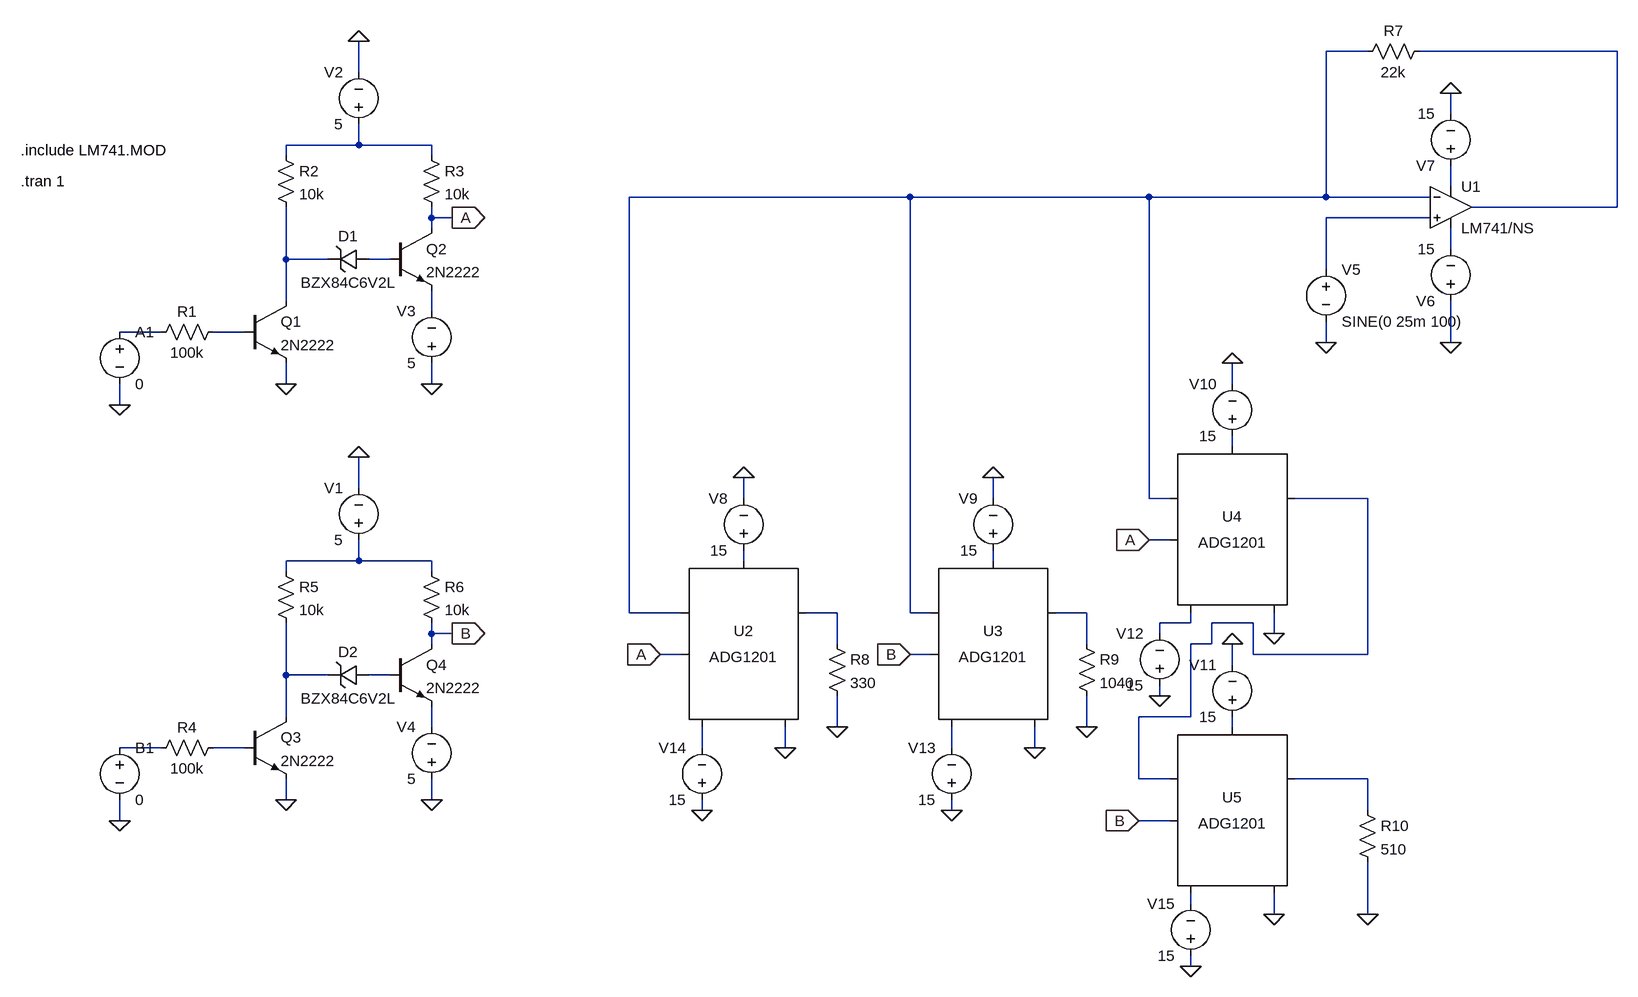
[diagram p0: schematic PGA_Modified_3Branch.asc]
PGA_Modified_3Branch.asc, the LTspice schematic file:
Version 4.1
SHEET 1 2020 1188
WIRE 1632 -240 1568 -240
WIRE 2016 -240 1712 -240
WIRE 80 -208 80 -256
WIRE 1760 -144 1760 -176
WIRE 80 -96 80 -128
WIRE 80 -96 -32 -96
WIRE 192 -96 80 -96
WIRE -32 -80 -32 -96
WIRE 192 -80 192 -96
WIRE 1760 -32 1760 -64
WIRE 928 -16 496 -16
WIRE 1296 -16 928 -16
WIRE 1568 -16 1568 -240
WIRE 1568 -16 1296 -16
WIRE 1728 -16 1568 -16
WIRE 2016 0 2016 -240
WIRE 2016 0 1792 0
WIRE 192 16 192 0
WIRE 224 16 192 16
WIRE 1728 16 1568 16
WIRE 192 32 192 16
WIRE 1760 64 1760 32
WIRE -32 80 -32 0
WIRE 32 80 -32 80
WIRE 128 80 96 80
WIRE 1568 96 1568 16
WIRE -32 144 -32 80
WIRE 192 160 192 128
WIRE -224 192 -288 192
WIRE -96 192 -144 192
WIRE 1568 208 1568 176
WIRE 1760 208 1760 144
WIRE -32 272 -32 240
WIRE 192 272 192 240
WIRE 1424 272 1424 240
WIRE -288 304 -288 272
WIRE 1424 368 1424 352
WIRE 80 432 80 384
WIRE 672 448 672 416
WIRE 1056 448 1056 416
WIRE 1296 448 1296 -16
WIRE 1328 448 1296 448
WIRE 1632 448 1520 448
WIRE 1328 512 1296 512
WIRE 80 544 80 512
WIRE 80 544 -32 544
WIRE 192 544 80 544
WIRE 672 544 672 528
WIRE 1056 544 1056 528
WIRE -32 560 -32 544
WIRE 192 560 192 544
WIRE 496 624 496 -16
WIRE 576 624 496 624
WIRE 816 624 768 624
WIRE 928 624 928 -16
WIRE 960 624 928 624
WIRE 1200 624 1152 624
WIRE 1360 640 1360 624
WIRE 1360 640 1312 640
WIRE 1456 640 1392 640
WIRE 192 656 192 640
WIRE 224 656 192 656
WIRE 1312 656 1312 640
WIRE 1488 656 1488 624
WIRE 192 672 192 656
WIRE 816 672 816 624
WIRE 1200 672 1200 624
WIRE 1392 672 1392 640
WIRE 1392 672 1360 672
WIRE 576 688 544 688
WIRE 960 688 928 688
WIRE 1456 688 1456 640
WIRE 1632 688 1632 448
WIRE 1632 688 1456 688
WIRE 1424 704 1424 672
WIRE -32 720 -32 640
WIRE 32 720 -32 720
WIRE 128 720 96 720
WIRE 1312 752 1312 736
WIRE -32 784 -32 720
WIRE 1360 784 1360 672
WIRE 1360 784 1280 784
WIRE 192 800 192 768
WIRE 816 800 816 752
WIRE 1200 800 1200 752
WIRE 1424 800 1424 784
WIRE -224 832 -288 832
WIRE -96 832 -144 832
WIRE 608 832 608 800
WIRE 736 832 736 800
WIRE 992 832 992 800
WIRE 1120 832 1120 800
WIRE 1280 880 1280 784
WIRE 1328 880 1280 880
WIRE 1632 880 1520 880
WIRE -32 912 -32 880
WIRE 192 912 192 880
WIRE 608 928 608 912
WIRE 992 928 992 912
WIRE 1632 928 1632 880
WIRE -288 944 -288 912
WIRE 1328 944 1280 944
WIRE 1360 1072 1360 1056
WIRE 1488 1088 1488 1056
WIRE 1632 1088 1632 1008
WIRE 1360 1168 1360 1152
FLAG 80 -256 0
FLAG -288 304 0
FLAG -32 272 0
FLAG 192 272 0
FLAG 224 16 A
IOPIN 224 16 Out
FLAG 80 384 0
FLAG -288 944 0
FLAG -32 912 0
FLAG 192 912 0
FLAG 224 656 B
IOPIN 224 656 Out
FLAG 1760 208 0
FLAG 1760 -176 0
FLAG 1568 208 0
FLAG 1488 656 0
FLAG 1488 1088 0
FLAG 1120 832 0
FLAG 736 832 0
FLAG 1424 672 0
FLAG 672 416 0
FLAG 1056 416 0
FLAG 1424 240 0
FLAG 1312 752 0
FLAG 608 928 0
FLAG 992 928 0
FLAG 1360 1168 0
FLAG 816 800 0
FLAG 1200 800 0
FLAG 1632 1088 0
FLAG 544 688 A
IOPIN 544 688 In
FLAG 928 688 B
IOPIN 928 688 In
FLAG 1296 512 A
IOPIN 1296 512 In
FLAG 1280 944 B
IOPIN 1280 944 In
SYMBOL OpAmps\\opamp2 1760 -64 R0
SYMATTR InstName U1
SYMATTR Value LM741/NS
SYMBOL npn -96 144 R0
SYMATTR InstName Q1
SYMATTR Value 2N2222
SYMBOL npn 128 32 R0
SYMATTR InstName Q2
SYMATTR Value 2N2222
SYMBOL voltage -288 176 R0
WINDOW 123 0 0 Left 0
WINDOW 39 0 0 Left 0
SYMATTR InstName A1
SYMATTR Value 0
SYMBOL res -128 176 R90
WINDOW 0 0 56 VBottom 2
WINDOW 3 32 56 VTop 2
SYMATTR InstName R1
SYMATTR Value 100k
SYMBOL zener 96 64 R90
WINDOW 0 -4 32 VBottom 2
WINDOW 3 36 32 VTop 2
SYMATTR InstName D1
SYMATTR Value BZX84C6V2L
SYMBOL res -48 -96 R0
SYMATTR InstName R2
SYMATTR Value 10k
SYMBOL res 176 -96 R0
SYMATTR InstName R3
SYMATTR Value 10k
SYMBOL voltage 80 -112 R180
WINDOW 0 24 96 Left 2
WINDOW 3 24 16 Left 2
WINDOW 123 0 0 Left 0
WINDOW 39 0 0 Left 0
SYMATTR InstName V2
SYMATTR Value 5
SYMBOL voltage 192 256 R180
WINDOW 0 24 96 Left 2
WINDOW 3 24 16 Left 2
WINDOW 123 0 0 Left 0
WINDOW 39 0 0 Left 0
SYMATTR InstName V3
SYMATTR Value 5
SYMBOL npn -96 784 R0
SYMATTR InstName Q3
SYMATTR Value 2N2222
SYMBOL npn 128 672 R0
SYMATTR InstName Q4
SYMATTR Value 2N2222
SYMBOL voltage -288 816 R0
WINDOW 123 0 0 Left 0
WINDOW 39 0 0 Left 0
SYMATTR InstName B1
SYMATTR Value 0
SYMBOL res -128 816 R90
WINDOW 0 0 56 VBottom 2
WINDOW 3 32 56 VTop 2
SYMATTR InstName R4
SYMATTR Value 100k
SYMBOL zener 96 704 R90
WINDOW 0 -4 32 VBottom 2
WINDOW 3 36 32 VTop 2
SYMATTR InstName D2
SYMATTR Value BZX84C6V2L
SYMBOL res -48 544 R0
SYMATTR InstName R5
SYMATTR Value 10k
SYMBOL res 176 544 R0
SYMATTR InstName R6
SYMATTR Value 10k
SYMBOL voltage 80 528 R180
WINDOW 0 24 96 Left 2
WINDOW 3 24 16 Left 2
WINDOW 123 0 0 Left 0
WINDOW 39 0 0 Left 0
SYMATTR InstName V1
SYMATTR Value 5
SYMBOL voltage 192 896 R180
WINDOW 0 24 96 Left 2
WINDOW 3 24 16 Left 2
WINDOW 123 0 0 Left 0
WINDOW 39 0 0 Left 0
SYMATTR InstName V4
SYMATTR Value 5
SYMBOL voltage 1568 80 R0
WINDOW 123 0 0 Left 0
WINDOW 39 0 0 Left 0
SYMATTR InstName V5
SYMATTR Value SINE(0 25m 100)
SYMBOL voltage 1760 160 R180
WINDOW 123 0 0 Left 0
WINDOW 39 0 0 Left 0
SYMATTR InstName V6
SYMATTR Value 15
SYMBOL voltage 1760 -48 R180
WINDOW 123 0 0 Left 0
WINDOW 39 0 0 Left 0
SYMATTR InstName V7
SYMATTR Value 15
SYMBOL res 1728 -256 R90
WINDOW 0 0 56 VBottom 2
WINDOW 3 32 56 VTop 2
SYMATTR InstName R7
SYMATTR Value 22k
SYMBOL Switches\\ADG1201 672 672 R0
SYMATTR InstName U2
SYMBOL Switches\\ADG1201 1056 672 R0
SYMATTR InstName U3
SYMBOL Switches\\ADG1201 1424 496 R0
SYMATTR InstName U4
SYMBOL Switches\\ADG1201 1424 928 R0
SYMATTR InstName U5
SYMBOL voltage 672 544 R180
WINDOW 0 24 96 Left 2
WINDOW 3 24 16 Left 2
WINDOW 123 0 0 Left 0
WINDOW 39 0 0 Left 0
SYMATTR InstName V8
SYMATTR Value 15
SYMBOL voltage 1056 544 R180
WINDOW 0 24 96 Left 2
WINDOW 3 24 16 Left 2
WINDOW 123 0 0 Left 0
WINDOW 39 0 0 Left 0
SYMATTR InstName V9
SYMATTR Value 15
SYMBOL voltage 1424 368 R180
WINDOW 0 24 96 Left 2
WINDOW 3 24 16 Left 2
WINDOW 123 0 0 Left 0
WINDOW 39 0 0 Left 0
SYMATTR InstName V10
SYMATTR Value 15
SYMBOL voltage 1424 800 R180
WINDOW 0 24 96 Left 2
WINDOW 3 24 16 Left 2
WINDOW 123 0 0 Left 0
WINDOW 39 0 0 Left 0
SYMATTR InstName V11
SYMATTR Value 15
SYMBOL voltage 1312 752 R180
WINDOW 0 24 96 Left 2
WINDOW 3 24 16 Left 2
WINDOW 123 0 0 Left 0
WINDOW 39 0 0 Left 0
SYMATTR InstName V12
SYMATTR Value 15
SYMBOL voltage 992 928 R180
WINDOW 0 24 96 Left 2
WINDOW 3 24 16 Left 2
WINDOW 123 0 0 Left 0
WINDOW 39 0 0 Left 0
SYMATTR InstName V13
SYMATTR Value 15
SYMBOL voltage 608 928 R180
WINDOW 0 24 96 Left 2
WINDOW 3 24 16 Left 2
WINDOW 123 0 0 Left 0
WINDOW 39 0 0 Left 0
SYMATTR InstName V14
SYMATTR Value 15
SYMBOL voltage 1360 1168 R180
WINDOW 0 24 96 Left 2
WINDOW 3 24 16 Left 2
WINDOW 123 0 0 Left 0
WINDOW 39 0 0 Left 0
SYMATTR InstName V15
SYMATTR Value 15
SYMBOL res 800 656 R0
SYMATTR InstName R8
SYMATTR Value 330
SYMBOL res 1184 656 R0
SYMATTR InstName R9
SYMATTR Value 1040
SYMBOL res 1616 912 R0
SYMATTR InstName R10
SYMATTR Value 510
TEXT -440 -88 Left 2 !.include LM741.MOD
TEXT -440 -40 Left 2 !.tran 1

The netlist it stands for:
* PGA_Modified_3Branch.asc
X§U1 N005 N001 N004 N006 N002 LM741/NS  ; pins In+ In- V+ V- OUT
Q1 N007 N011 0 0 2N2222
Q2 A N008 N009 0 2N2222
V§A1 N010 0 0
R1 N011 N010 100k
D1 N008 N007 BZX84C6V2L
R2 N003 N007 10k
R3 N003 A 10k
V2 N003 0 5
V3 0 N009 5
Q3 N020 N025 0 0 2N2222
Q4 B N021 N022 0 2N2222
V§B1 N024 0 0
R4 N025 N024 100k
D2 N021 N020 BZX84C6V2L
R5 N014 N020 10k
R6 N014 B 10k
V1 N014 0 5
V4 0 N022 5
V5 N005 0 SINE(0 25m 100)
V6 0 N006 15
V7 N004 0 15
R7 N002 N001 22k
X§U2 A N017 N001 N026 0 N015 ADG1201
X§U3 B N018 N001 N027 0 N016 ADG1201
X§U4 A N013 N001 N019 0 N012 ADG1201
X§U5 B N028 N013 N029 0 N023 ADG1201
V8 N015 0 15
V9 N016 0 15
V10 N012 0 15
V11 N023 0 15
V12 0 N019 15
V13 0 N027 15
V14 0 N026 15
V15 0 N029 15
R8 N017 0 330
R9 N018 0 1040
R10 N028 0 510
.model D D
.lib standard.dio
.model NPN NPN
.model PNP PNP
.lib standard.bjt
.include LM741.MOD
.tran 1
.lib ADG1201.sub
.backanno
.end